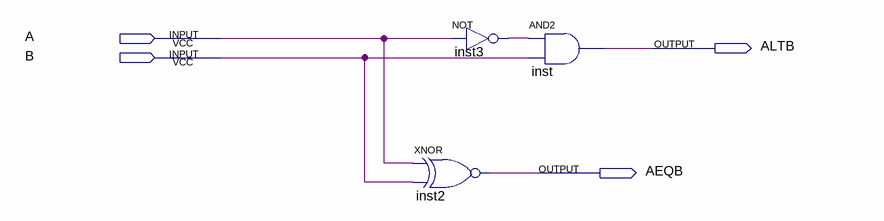
[diagram p0: schematic sheet]
// Quartus schematic COMPARATOR.bdf as structural Verilog: 3 symbols, 4 pins
module COMPARATOR (
  input  A,
  input  B,
  output ALTB,
  output AEQB
);

  wire inst3_out;

  xnor inst2 (AEQB, A, B);
  not inst3 (inst3_out, A);
  and inst (ALTB, inst3_out, B);
endmodule
